# Altium schematic sheet [4]Relays_Control.SchDoc
size A4; SheetNumber: 5; SheetTotal: 7
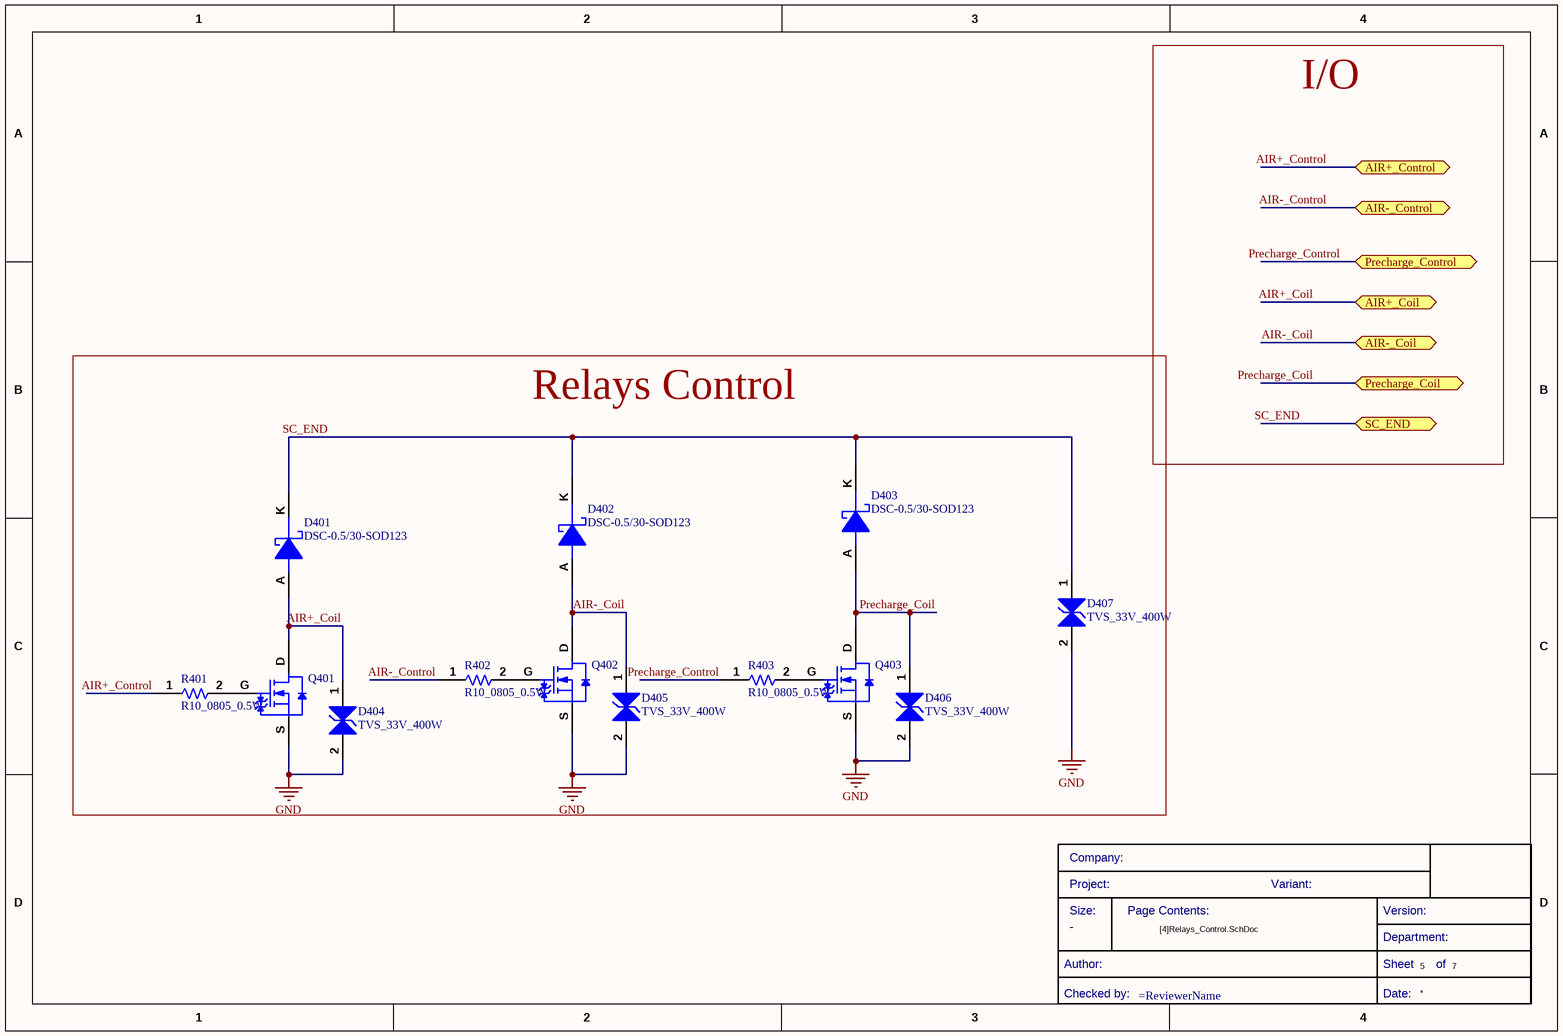
[diagram p0: [4]Relays_Control.SchDoc]

## Parts
?  (no value)  (graphical)
D401  DSC-0.5/30-SOD123  [DSC-SOD123]
D402  DSC-0.5/30-SOD123  [DSC-SOD123]
D403  DSC-0.5/30-SOD123  [DSC-SOD123]
D404  TVS_33V_400W  [WE-TVSP_DO-214AC_Bidirectional]
D405  TVS_33V_400W  [WE-TVSP_DO-214AC_Bidirectional]
D406  TVS_33V_400W  [WE-TVSP_DO-214AC_Bidirectional]
D407  TVS_33V_400W  [WE-TVSP_DO-214AC_Bidirectional]
Q401  SQ2318CES-T1_GE3  [SOT95P245X110-3N]  (value not drawn)
Q402  SQ2318CES-T1_GE3  [SOT95P245X110-3N]  (value not drawn)
Q403  SQ2318CES-T1_GE3  [SOT95P245X110-3N]  (value not drawn)
R401  R10_0805_0.5W  [0805]
R402  R10_0805_0.5W  [0805]
R403  R10_0805_0.5W  [0805]

## Blocks framed on the sheet
Relays Control: D401-D407 Q401-Q403 R401-R403

## Ports
AIR+_Coil (bidir, see Master_HV_PCB[1A]), AIR+_Control (bidir, see Master_HV_PCB[1A]), AIR-_Coil (bidir, see Master_HV_PCB[1A]), AIR-_Control (bidir, see Master_HV_PCB[1A]), Precharge_Coil (bidir, see Master_HV_PCB[1A]), Precharge_Control (bidir, see Master_HV_PCB[1A]), SC_END (bidir, see Master_HV_PCB[1A], [1]Shutdown[1A])

## Nets
GND: D404.2 D405.2 D406.2 D407.2 Q401.S Q402.S Q403.S
AIR+_Coil: D401.A D404.1 Q401.D ; port AIR+_Coil
AIR+_Control: R401.1 ; port AIR+_Control
AIR-_Coil: D402.A D405.1 Q402.D ; port AIR-_Coil
AIR-_Control: R402.1 ; port AIR-_Control
Precharge_Coil: D403.A D406.1 Q403.D ; port Precharge_Coil
Precharge_Control: R403.1 ; port Precharge_Control
SC_END: D401.K D402.K D403.K D407.1 ; port SC_END
NetQ401_G: Q401.G R401.2
NetQ402_G: Q402.G R402.2
NetQ403_G: Q403.G R403.2

## Notes on the sheet
- I/O
- Size:
- Company:
- Project:
- Page Contents:
- Variant:
- Version:
- Checked by:
- Author:
- Sheet
- Date:
- Department:
- of

## Library data of the parts
? = CMP-00043-6: Standard Title Block
D401-D403 = CMP-00165-1: VR=30V IF=500mA 30pF P=410mW; Max Reverse Leakage Current: 130uA; .Creator: GP; Max Reverse Voltage (DC): 30V; Element Configuration: Single; Average Rectified Current: 500mA; Peak Non-Repetitive Surge Current: 5.5A; Polarity: Standard; Forward Voltage: 430mV; ComponentLink10Description: https://datasheet.ciiva.com/910/mbr0530-910518.pdf?src-supplier=Digi-Key; ComponentLink1Description: Datasheet; Category: Diode; ComponentLink3Description: https://datasheet.ciiva.com/30479/0900766b810e2512-30479401.pdf?src-supplier=RSComponents; ComponentLink5Description: https://datasheet.ciiva.com/910/mbr0530-910516.pdf?src-supplier=Digi-Key; Stock 1: 9; Weight: 0.03g; Source: Filter components.SchLib; ComponentLink2Description: Where buy it; Series: -; Mount: Surface Mount; Max Repetitive Reverse Voltage (Vrrm): 30V; Pricing 1: 1=0,34400, 10=0,23900, 100=0,12200, 500=0,10000 (USD); Design Item ID: DSC-0.5/30-SOD123; ComponentLink8Description: https://datasheet.ciiva.com/17318/mbr0530-17318568.pdf?src-supplier=Future+Electronics; Current Rating: 500mA; ComponentLink1URL: *; Length: 2.7mm; Max Reverse Current: 130uA; ComponentLink7URL: https://datasheet.ciiva.com/8300/mbr0530-8300905.pdf?src-supplier=Avnet; ComponentLink9URL: https://datasheet.ciiva.com/15144/getdatasheetpartid-86760-15144598.pdf?src-supplier=Verical; Radiation Hardening: No; Height: 1.03mm; ComponentLink4Description: https://datasheet.ciiva.com/34301/974753-34301826.pdf?src-supplier=Jameco; ComponentLink7Description: https://datasheet.ciiva.com/8300/mbr0530-8300905.pdf?src-supplier=Avnet; Package Quantity: 1; Forward Current: 500mA; ComponentLink5URL: https://datasheet.ciiva.com/910/mbr0530-910516.pdf?src-supplier=Digi-Key; Max Surge Current: 5.5A; Lead Free: Lead Free; ComponentLink2URL: *; Max Forward Surge Current (Ifsm): 5.5A; Output Current: 500mA; Voltage Rating (DC): 30V; Contact Plating: Tin,Matte; RoHS Compliant: Yes; REACH SVHC: No SVHC; ComponentLink10URL: https://datasheet.ciiva.com/910/mbr0530-910518.pdf?src-supplier=Digi-Key; ComponentLink4URL: https://datasheet.ciiva.com/34301/974753-34301826.pdf?src-supplier=Jameco; ComponentLink6URL: https://datasheet.ciiva.com/25931/mbr0530-25931989.pdf?src-supplier=Avnet+Europe; ComponentLink6Description: https://datasheet.ciiva.com/25931/mbr0530-25931989.pdf?src-supplier=Avnet+Europe; Width: 1.6mm; ComponentLink3URL: https://datasheet.ciiva.com/30479/0900766b810e2512-30479401.pdf?src-supplier=RSComponents; ComponentLink9Description: https://datasheet.ciiva.com/15144/getdatasheetpartid-86760-15144598.pdf?src-supplier=Verical; ComponentLink8URL: https://datasheet.ciiva.com/17318/mbr0530-17318568.pdf?src-supplier=Future+Electronics
D404-D407 = CMP-004-00003-1: Trans Voltage Suppressor Diode, 400W, Bidirectional, 1 Element, Silicon, DO-214AC; Min Operating Temperature: -65°C; Pins: 2; RoHS Compliant: Yes; Max Operating Temperature: 150°C
Q401-Q403 = CMP-013-00002-1: Mosfet, N-channel, 40V, 7A, SOT-23 Rohs Compliant: Yes
R401-R403 = CMP-009-00031-1: Fixed Resistor, Metal Glaze/thick Film, 0.5W, 10ohm, 150V, 1% +/-Tol, 100ppm/Cel, Surface Mount, 0805; Power: 500mW; Value: 10; Tolerance: 1%; Max Operating Temperature: 155°C; RoHS Compliant: Yes; Case/Package: 0805; Min Operating Temperature: -55°C; Mounting Technology: Surface Mount; Pins: 2